# Altium schematic sheet Hydrophones.SchDoc
size A; SheetNumber: 7
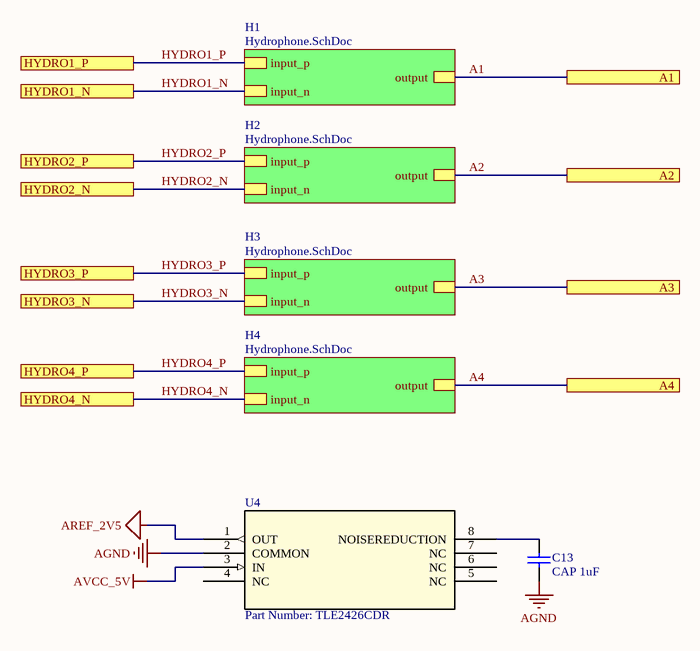
[diagram p0: Hydrophones.SchDoc]

## Parts
C13  CAP 1uF  [CAPC0603(1608)100_N]
U4  Part Number: TLE2426CDR  [D8]

## Sub-sheets
H1 = Hydrophone.SchDoc: output, input_p, input_n
H2 = Hydrophone.SchDoc: output, input_p, input_n
H3 = Hydrophone.SchDoc: output, input_p, input_n
H4 = Hydrophone.SchDoc: output, input_p, input_n

## Ports
A1, A2, A3, A4, HYDRO1_N, HYDRO1_P, HYDRO2_N, HYDRO2_P, HYDRO3_N, HYDRO3_P, HYDRO4_N, HYDRO4_P

## Nets
AGND: C13.1 U4.2(COMMON)
AREF_2V5: U4.1(OUT)
AVCC_5V: U4.3(IN)
A1: port A1, sheet H1/output
A2: port A2, sheet H2/output
A3: port A3, sheet H3/output
A4: port A4, sheet H4/output
HYDRO1_N: port HYDRO1_N, sheet H1/input_n
HYDRO1_P: port HYDRO1_P, sheet H1/input_p
HYDRO2_N: port HYDRO2_N, sheet H2/input_n
HYDRO2_P: port HYDRO2_P, sheet H2/input_p
HYDRO3_N: port HYDRO3_N, sheet H3/input_n
HYDRO3_P: port HYDRO3_P, sheet H3/input_p
HYDRO4_N: port HYDRO4_N, sheet H4/input_n
HYDRO4_P: port HYDRO4_P, sheet H4/input_p
NetC13_2: C13.2 U4.8(NOISEREDUCTION)

Not connected (* = marked no-connect by the designer): U4 4(NC) 5(NC) 6(NC) 7(NC)

## Library data of the parts
C13 = CMP-1035-02736-1: CAP 1uF 16V ±5% 0603 (1608 Metric) Thickness 1mm SMD; Case-Metric: 1608; Case-EIA: 0603; Tolerance: Â±5%; Technology: SMT; Max Thickness: 1 mm; Rated Voltage: 16 V; Value: 1uF
U4 = TLE2426CDR: No Description Available; Vendor: Texas Instruments; Built_By: EMA_UL_Team; Manufacturer_Part_Number: TLE2426CDR; Copyright: Copyright (C) 2018 Accelerated Designs. All rights reserved; RefDes: RefDes; Type: DEV; Value: Value